# Altium schematic sheet 2 MXM Connector 2.SchDoc: MXM Connector
size C; DocumentNumber: 3; SheetNumber: 3; SheetTotal: 16
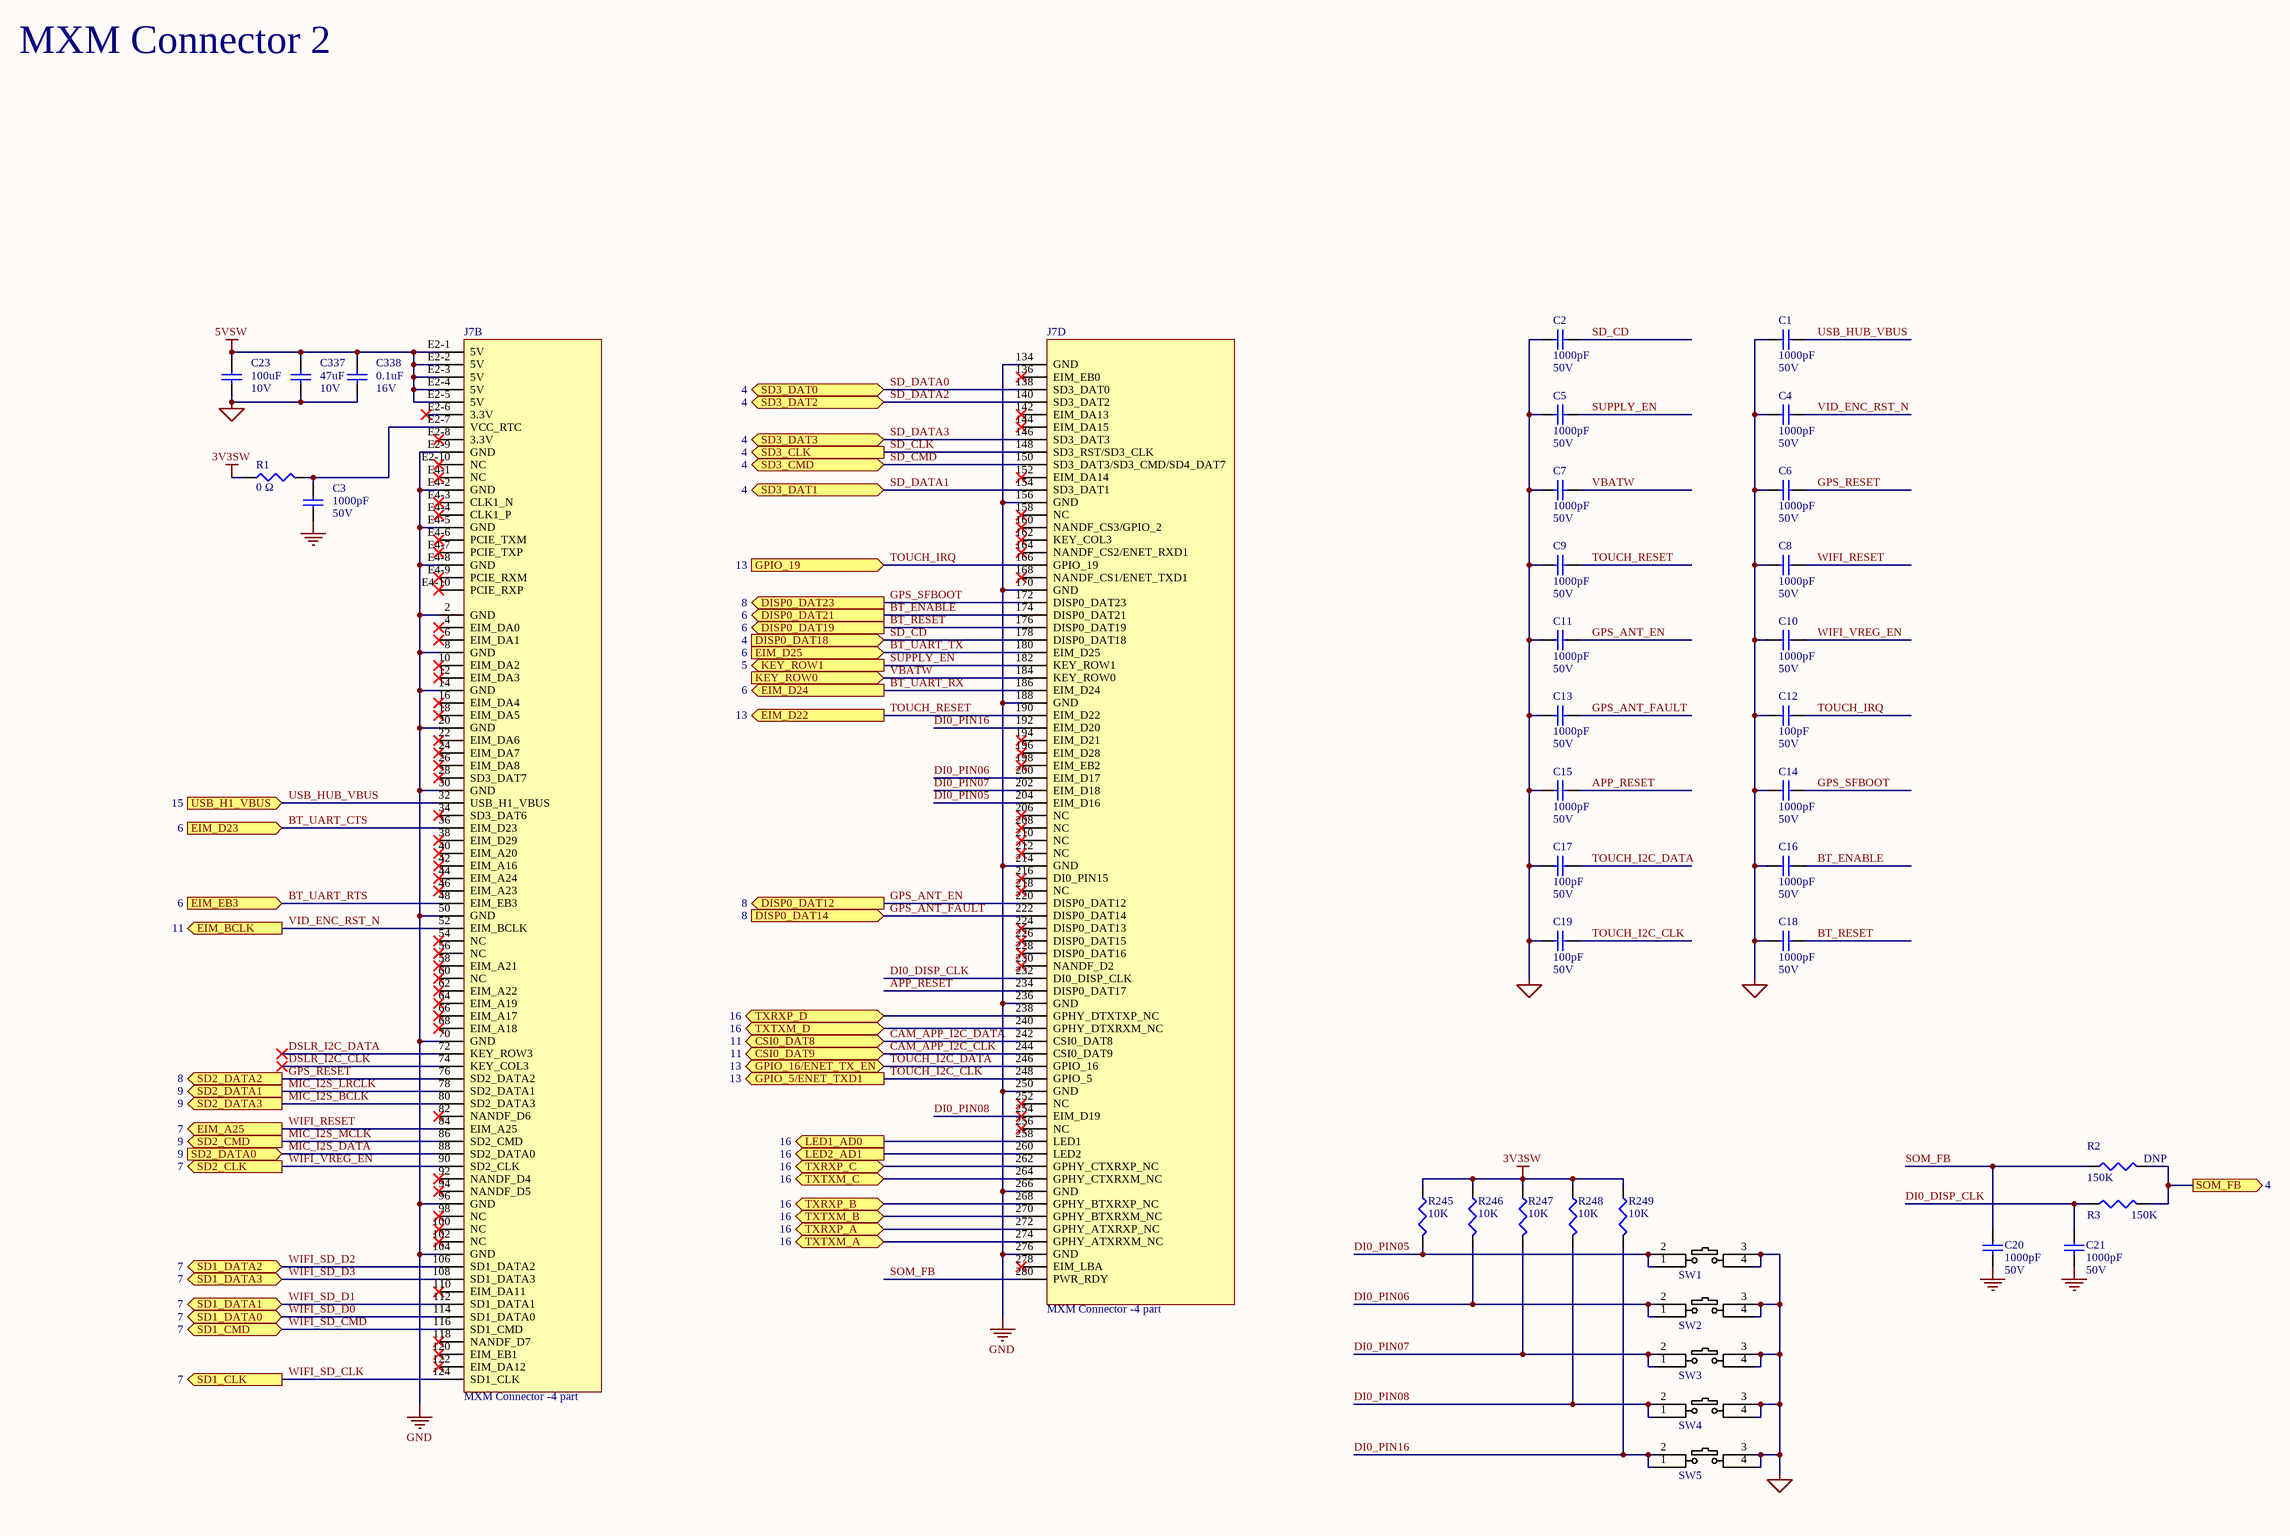
[diagram p0: 2 MXM Connector 2.SchDoc]

## Parts
C1  value 1000pF  Voltage: 50V  [CAP_0603]  (hidden comment: Cap 1000pF 50V 0603)
C2  value 1000pF  Voltage: 50V  [CAP_0603]  (hidden comment: Cap 1000pF 50V 0603)
C3  value 1000pF  Voltage: 50V  [CAP_0603]  (hidden comment: Cap 1000pF 50V 0603)
C4  value 1000pF  Voltage: 50V  [CAP_0603]  (hidden comment: Cap 1000pF 50V 0603)
C5  value 1000pF  Voltage: 50V  [CAP_0603]  (hidden comment: Cap 1000pF 50V 0603)
C6  value 1000pF  Voltage: 50V  [CAP_0603]  (hidden comment: Cap 1000pF 50V 0603)
C7  value 1000pF  Voltage: 50V  [CAP_0603]  (hidden comment: Cap 1000pF 50V 0603)
C8  value 1000pF  Voltage: 50V  [CAP_0603]  (hidden comment: Cap 1000pF 50V 0603)
C9  value 1000pF  Voltage: 50V  [CAP_0603]  (hidden comment: Cap 1000pF 50V 0603)
C10  value 1000pF  Voltage: 50V  [CAP_0603]  (hidden comment: Cap 1000pF 50V 0603)
C11  value 1000pF  Voltage: 50V  [CAP_0603]  (hidden comment: Cap 1000pF 50V 0603)
C12  value 100pF  Voltage: 50V  [CAP_0402]  (hidden comment: Cap 100pF 50V 0402)
C13  value 1000pF  Voltage: 50V  [CAP_0603]  (hidden comment: Cap 1000pF 50V 0603)
C14  value 1000pF  Voltage: 50V  [CAP_0603]  (hidden comment: Cap 1000pF 50V 0603)
C15  value 1000pF  Voltage: 50V  [CAP_0603]  (hidden comment: Cap 1000pF 50V 0603)
C16  value 1000pF  Voltage: 50V  [CAP_0603]  (hidden comment: Cap 1000pF 50V 0603)
C17  value 100pF  Voltage: 50V  [CAP_0402]  (hidden comment: Cap 100pF 50V 0402)
C18  value 1000pF  Voltage: 50V  [CAP_0603]  (hidden comment: Cap 1000pF 50V 0603)
C19  value 100pF  Voltage: 50V  [CAP_0402]  (hidden comment: Cap 100pF 50V 0402)
C20  value 1000pF  Voltage: 50V  [CAP_0603]  (hidden comment: Cap 1000pF 50V 0603)
C21  value 1000pF  Voltage: 50V  [CAP_0603]  (hidden comment: Cap 1000pF 50V 0603)
C23  value 100uF  Voltage: 10V  [CAP_1210]  (hidden comment: Cap 100uF 10V 1210)
C337  value 47uF  Voltage: 10V  [CAP_1206]  (hidden comment: Cap 47uF 10V 1206)
C338  value 0.1uF  Voltage: 16V  [CAP_0402]  (hidden comment: Cap 0.1uF 16V 0402)
J7  MXM Connector -4 part  [CON_CLE9990-0402F]  (parts B,D of 4)
R1  value 0 Ω  [RES_0402]  (hidden comment: Res 0 ohm 0.1W)
R2  value 150K  [RES_0402]  (hidden comment: Res 150K 0.063W)
R3  value 150K  [RES_0402]  (hidden comment: Res 150K 0.063W)
R245  value 10K  [RES_0402]  (hidden comment: Res 10K 0.063W)
R246  value 10K  [RES_0402]  (hidden comment: Res 10K 0.063W)
R247  value 10K  [RES_0402]  (hidden comment: Res 10K 0.063W)
R248  value 10K  [RES_0402]  (hidden comment: Res 10K 0.063W)
R249  value 10K  [RES_0402]  (hidden comment: Res 10K 0.063W)
SW1  PTS645SH50SMTR92 LFS  [SW_PTS645SH50SMTR92]  (value not drawn)
SW2  PTS645SH50SMTR92 LFS  [SW_PTS645SH50SMTR92]  (value not drawn)
SW3  PTS645SH50SMTR92 LFS  [SW_PTS645SH50SMTR92]  (value not drawn)
SW4  PTS645SH50SMTR92 LFS  [SW_PTS645SH50SMTR92]  (value not drawn)
SW5  PTS645SH50SMTR92 LFS  [SW_PTS645SH50SMTR92]  (value not drawn)

## Ports
CSI0_DAT8 (bidir, see 11), CSI0_DAT9 (bidir, see 11), DISP0_DAT12 (out, see 8), DISP0_DAT14 (in, see 8), DISP0_DAT18 (in, see 4), DISP0_DAT19 (out, see 6), DISP0_DAT21 (out, see 6), DISP0_DAT23 (out, see 8), EIM_A25 (out, see 7), EIM_BCLK (out, see 11), EIM_D22 (out, see 13), EIM_D23 (in, see 6), EIM_D24 (out, see 6), EIM_D25 (in, see 6), EIM_EB3 (in, see 6), GPIO_5/ENET_TXD1 (out, see 13), GPIO_16/ENET_TX_EN (bidir, see 13), GPIO_19 (in, see 13), KEY_ROW0 (in), KEY_ROW1 (out, see 5), LED1_AD0 (out, see 16), LED2_AD1 (out, see 16), SD1_CLK (out, see 7), SD1_CMD (bidir, see 7), SD1_DATA0 (bidir, see 7), SD1_DATA1 (bidir, see 7), SD1_DATA2 (bidir, see 7), SD1_DATA3 (bidir, see 7), SD2_CLK (out, see 7), SD2_CMD (out, see 9), SD2_DATA0 (in, see 9), SD2_DATA1 (out, see 9), SD2_DATA2 (out, see 8), SD2_DATA3 (out, see 9), SD3_CLK (out, see 4), SD3_CMD (bidir, see 4), SD3_DAT0 (bidir, see 4), SD3_DAT1 (bidir, see 4), SD3_DAT2 (bidir, see 4), SD3_DAT3 (bidir, see 4), SOM_FB (out, see 4), TXRXP_A (bidir, see 16), TXRXP_B (bidir, see 16), TXRXP_C (bidir, see 16), TXRXP_D (bidir, see 16), TXTXM_A (bidir, see 16), TXTXM_B (bidir, see 16), TXTXM_C (bidir, see 16), TXTXM_D (bidir, see 16), USB_H1_VBUS (in, see 15)

## Nets
3V3SW: R1.1 R245.1 R246.1 R247.1 R248.1 R249.1
5VSW: C23.1 C337.1 C338.1 J7.E2-1(5V) J7.E2-2(5V) J7.E2-3(5V) J7.E2-4(5V) J7.E2-5(5V)
GND: C1.2 C2.2 C3.2 C4.2 C5.2 C6.2 C7.2 C8.2 C9.2 C10.2 C11.2 C12.2 C13.2 C14.2 C15.2 C16.2 C17.2 C18.2 C19.2 C20.2 C21.2 C23.2 C337.2 C338.2 J7.2(GND) J7.8(GND) J7.14(GND) J7.20(GND) J7.30(GND) J7.50(GND) J7.70(GND) J7.96(GND) J7.104(GND) J7.134(GND) J7.156(GND) J7.170(GND) J7.188(GND) J7.214(GND) J7.236(GND) J7.250(GND) J7.266(GND) J7.276(GND) J7.E2-9(GND) J7.E4-2(GND) J7.E4-5(GND) J7.E4-8(GND) SW1.3 SW1.4 SW2.3 SW2.4 SW3.3 SW3.4 SW4.3 SW4.4 SW5.3 SW5.4
APP_RESET: C15.1 J7.234(DISP0_DAT17)
BT_ENABLE: C16.1 J7.174(DISP0_DAT21) ; port DISP0_DAT21
BT_RESET: C18.1 J7.176(DISP0_DAT19) ; port DISP0_DAT19
BT_UART_CTS: J7.36(EIM_D23) ; port EIM_D23
BT_UART_RTS: J7.48(EIM_EB3) ; port EIM_EB3
BT_UART_RX: J7.186(EIM_D24) ; port EIM_D24
BT_UART_TX: J7.180(EIM_D25) ; port EIM_D25
CAM_APP_I2C_CLK: J7.244(CSI0_DAT9) ; port CSI0_DAT9
CAM_APP_I2C_DATA: J7.242(CSI0_DAT8) ; port CSI0_DAT8
DI0_DISP_CLK: C21.1 J7.232(DI0_DISP_CLK) R3.1
DI0_PIN05: J7.204(EIM_D16) R245.2 SW1.1 SW1.2
DI0_PIN06: J7.200(EIM_D17) R246.2 SW2.1 SW2.2
DI0_PIN07: J7.202(EIM_D18) R247.2 SW3.1 SW3.2
DI0_PIN08: J7.254(EIM_D19) R248.2 SW4.1 SW4.2
DI0_PIN16: J7.192(EIM_D20) R249.2 SW5.1 SW5.2
DSLR_I2C_CLK: J7.74(KEY_COL3)
DSLR_I2C_DATA: J7.72(KEY_ROW3)
GPS_ANT_EN: C11.1 J7.220(DISP0_DAT12) ; port DISP0_DAT12
GPS_ANT_FAULT: C13.1 J7.222(DISP0_DAT14) ; port DISP0_DAT14
GPS_RESET: C6.1 J7.76(SD2_DATA2) ; port SD2_DATA2
GPS_SFBOOT: C14.1 J7.172(DISP0_DAT23) ; port DISP0_DAT23
LED1_AD0: J7.258(LED1) ; port LED1_AD0
LED2_AD1: J7.260(LED2) ; port LED2_AD1
MIC_I2S_BCLK: J7.80(SD2_DATA3) ; port SD2_DATA3
MIC_I2S_DATA: J7.88(SD2_DATA0) ; port SD2_DATA0
MIC_I2S_LRCLK: J7.78(SD2_DATA1) ; port SD2_DATA1
MIC_I2S_MCLK: J7.86(SD2_CMD) ; port SD2_CMD
SD_CD: C2.1 J7.178(DISP0_DAT18) ; port DISP0_DAT18
SD_CLK: J7.148(SD3_RST/SD3_CLK) ; port SD3_CLK
SD_CMD: J7.150(SD3_DAT3/SD3_CMD/SD4_DAT7) ; port SD3_CMD
SD_DATA0: J7.138(SD3_DAT0) ; port SD3_DAT0
SD_DATA1: J7.154(SD3_DAT1) ; port SD3_DAT1
SD_DATA2: J7.140(SD3_DAT2) ; port SD3_DAT2
SD_DATA3: J7.146(SD3_DAT3) ; port SD3_DAT3
SOM_FB: C20.1 J7.280(PWR_RDY) R2.1
SOM_FB: R2.2 R3.2 ; port SOM_FB  [a separate net that carries the same name]
SUPPLY_EN: C5.1 J7.182(KEY_ROW1) ; port KEY_ROW1
TOUCH_I2C_CLK: C19.1 J7.248(GPIO_5) ; port GPIO_5/ENET_TXD1
TOUCH_I2C_DATA: C17.1 J7.246(GPIO_16) ; port GPIO_16/ENET_TX_EN
TOUCH_IRQ: C12.1 J7.166(GPIO_19) ; port GPIO_19
TOUCH_RESET: C9.1 J7.190(EIM_D22) ; port EIM_D22
TXRXP_A: J7.272(GPHY_ATXRXP_NC) ; port TXRXP_A
TXRXP_B: J7.268(GPHY_BTXRXP_NC) ; port TXRXP_B
TXRXP_C: J7.262(GPHY_CTXRXP_NC) ; port TXRXP_C
TXRXP_D: J7.238(GPHY_DTXTXP_NC) ; port TXRXP_D
TXTXM_A: J7.274(GPHY_ATXRXM_NC) ; port TXTXM_A
TXTXM_B: J7.270(GPHY_BTXRXM_NC) ; port TXTXM_B
TXTXM_C: J7.264(GPHY_CTXRXM_NC) ; port TXTXM_C
TXTXM_D: J7.240(GPHY_DTXRXM_NC) ; port TXTXM_D
USB_HUB_VBUS: C1.1 J7.32(USB_H1_VBUS) ; port USB_H1_VBUS
VBATW: C7.1 J7.184(KEY_ROW0) ; port KEY_ROW0
VID_ENC_RST_N: C4.1 J7.52(EIM_BCLK) ; port EIM_BCLK
WIFI_RESET: C8.1 J7.84(EIM_A25) ; port EIM_A25
WIFI_SD_CLK: J7.124(SD1_CLK) ; port SD1_CLK
WIFI_SD_CMD: J7.116(SD1_CMD) ; port SD1_CMD
WIFI_SD_D0: J7.114(SD1_DATA0) ; port SD1_DATA0
WIFI_SD_D1: J7.112(SD1_DATA1) ; port SD1_DATA1
WIFI_SD_D2: J7.106(SD1_DATA2) ; port SD1_DATA2
WIFI_SD_D3: J7.108(SD1_DATA3) ; port SD1_DATA3
WIFI_VREG_EN: C10.1 J7.90(SD2_CLK) ; port SD2_CLK
NetC3_1: C3.1 J7.E2-7(VCC_RTC) R1.2

Not connected (* = marked no-connect by the designer): J7 4(EIM_DA0)* 6(EIM_DA1)* 10(EIM_DA2)* 12(EIM_DA3)* 16(EIM_DA4)* 18(EIM_DA5)* 22(EIM_DA6)* 24(EIM_DA7)* 26(EIM_DA8)* 28(SD3_DAT7)* 34(SD3_DAT6)* 38(EIM_D29)* 40(EIM_A20)* 42(EIM_A16)* 44(EIM_A24)* 46(EIM_A23)* 54(NC)* 56(NC)* 58(EIM_A21)* 60(NC)* 62(EIM_A22)* 64(EIM_A19)* 66(EIM_A17)* 68(EIM_A18)* 82(NANDF_D6)* 92(NANDF_D4)* 94(NANDF_D5)* 98(NC)* 100(NC)* 102(NC)* 110(EIM_DA11)* 118(NANDF_D7)* 120(EIM_EB1)* 122(EIM_DA12)* 136(EIM_EB0)* 142(EIM_DA13)* 144(EIM_DA15)* 152(EIM_DA14)* 158(NC)* 160(NANDF_CS3/GPIO_2)* 162(KEY_COL3)* 164(NANDF_CS2/ENET_RXD1)* 168(NANDF_CS1/ENET_TXD1)* 194(EIM_D21)* 196(EIM_D28)* 198(EIM_EB2)* 206(NC)* 208(NC)* 210(NC)* 212(NC)* 216(DI0_PIN15)* 218(NC)* 224(DISP0_DAT13)* 226(DISP0_DAT15)* 228(DISP0_DAT16)* 230(NANDF_D2)* 252(NC)* 256(NC)* 278(EIM_LBA)* E2-6(3.3V)* E2-8(3.3V)* E2-10(NC)* E4-1(NC)* E4-3(CLK1_N)* E4-4(CLK1_P)* E4-6(PCIE_TXM)* E4-7(PCIE_TXP)* E4-9(PCIE_RXM)* E4-10(PCIE_RXP)*

## Notes on the sheet
- MXM Connector 2
- First View Consultants
- Austin, Tx
- 512.582.9102
- Drawn:
- Title:
- Sheet
- of
- firstviewconsultants.com
- FVC #:
- Checked:
- Approved:
- Date:
- File:
- Rev.
- Time:

## Library data of the parts
C1-C11 C13-C16 C18 C20 C21 = Cap 1000pF 50V 0603: Cap, Cer, 1000pF, 50V, 10%, X7S, 0603; Manufacturer: Yageo; Manufacturer #: CC0603KRX7R9BB102; Have Footprint: yes; Tolerance: 10%; PACKAGE: 0402
C12 C17 C19 = Cap 100pF 50V 0402: Cap, Cer, 100pF, 50V, 5%, C0G/NP0, 0402; Manufacturer #: CC0402JRNPO9BN101; Manufacturer: Yageo; Have Footprint: yes; PACKAGE: 0402; Tolerance: 5%
C23 = Cap 100uF 10V 1210: Cap, Cer, 100uF, 10V, 20%, X5R, 1210; Manufacturer #: C1210C107M8PACTU; Manufacturer: Kemet; Package: 1210
C337 = Cap 47uF 10V 1206: Cap, Cer, 47uF, 10V, 20%, X5R, 1206; Manufacturer #: GRM31CR61A476ME15L; Manufacturer: Murata Electronics North America; Tolerance: ±10%; Have Footprint: yes; Package: 1206
C338 = Cap 0.1uF 16V 0402: Cap, Cer, 0.1uF, 16V, 10%, X7R, 0402; Manufacturer #: GRM155R71C104KA88D; Manufacturer: Murata Electronics North America; Have Footprint: yes; Package: 0402; Tolerance: ±10%
J7 = MXM Connector -4 part: Conn, 314-pin, SOM i.MX6, SMD; Manufacturer #: CLE9990-0402F; Manufacturer: SMK Electronics; Operating Temperature: -40℃ ~ +105℃
R1 = Res 0 ohm 0.1W: Res, 0 ohm, 1/16W, 0402; Manufacturer #: CRCW04020000Z0ED; Manufacturer: Vishay Dale; Have Footprint: yes; Package: 0402
R2 R3 = Res 150K 0.063W: Res, 150K, 0.063W, 1%, 0402; Manufacturer #: MCR01MRTF1503; Manufacturer: Rohm Semiconductor; Have Footprint: yes; Package: 0402; Tolerance: 1%
  R2: DNP: DNP
R245-R249 = Res 10K 0.063W: Res, 10K, 1/16W, 1%, 0402; Manufacturer #: RC0402FR-0710KL; Manufacturer: Yageo; Have Footprint: yes; Package: 0402
SW1-SW5 = PTS645SH50SMTR92 LFS: Switch, Tact, SPST-NO, 0.05A, 12V, SMD; Manufacturer: C&K Components; Have Footprint: yes; Cost: 0.25; Value: *; Manufacturer #: PTS645SH50SMTR92 LFS